# EAGLE schematic high-level-diagram (EAGLE 7.2.0)
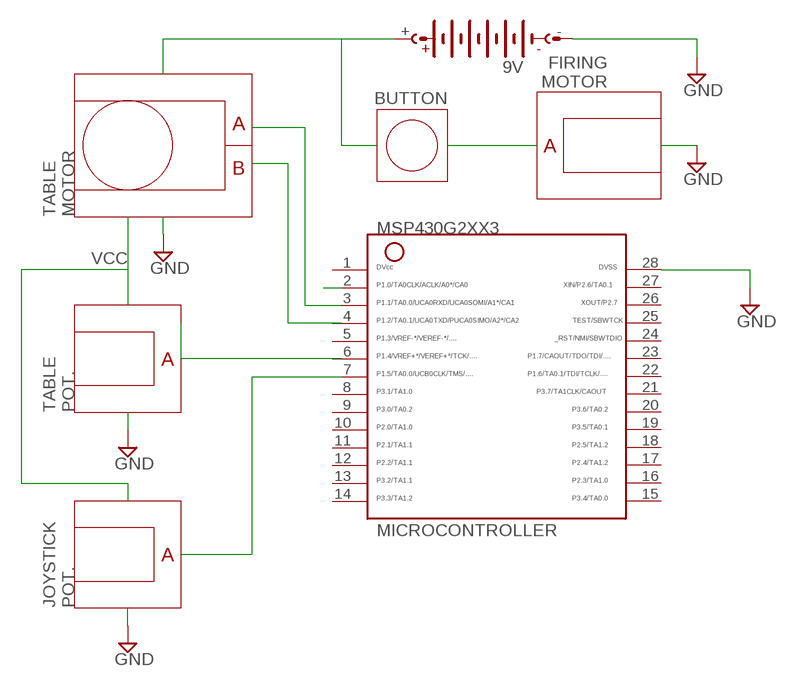
[diagram p0: schematic, sheet 1]

## Parts
9V  AB9V  [AB9V]
MICROCONTROLLER  MSP430G2553  G2XX3---PW28  [PW28]

## Nets
GND: 9V.- MICROCONTROLLER.28
N$4: 9V.+
Unconnected: MICROCONTROLLER.1 MICROCONTROLLER.2 MICROCONTROLLER.3 MICROCONTROLLER.4 MICROCONTROLLER.5 MICROCONTROLLER.6 MICROCONTROLLER.7 MICROCONTROLLER.8 MICROCONTROLLER.9 MICROCONTROLLER.10 MICROCONTROLLER.11 MICROCONTROLLER.12 MICROCONTROLLER.13 MICROCONTROLLER.14 MICROCONTROLLER.15 MICROCONTROLLER.16 MICROCONTROLLER.17 MICROCONTROLLER.18 MICROCONTROLLER.19 MICROCONTROLLER.20 MICROCONTROLLER.21 MICROCONTROLLER.22 MICROCONTROLLER.23 MICROCONTROLLER.24 MICROCONTROLLER.25 MICROCONTROLLER.26 MICROCONTROLLER.27

## Notes on the sheet
- FIRING
  MOTOR
- BUTTON
- TABLE
  MOTOR
- TABLE
  POT.
- JOYSTICK
  POT.

## Library data of the parts
9V = battery:AB9V: 9-V BATTERY CLIP
MICROCONTROLLER = TI_MSP430_v16:G2XX3---PW28: MSP430G2XX1 TSSOP (PW) 28 Pin Package